# Altium schematic sheet 07 POWER.SchDoc
size 420 x 297 mm
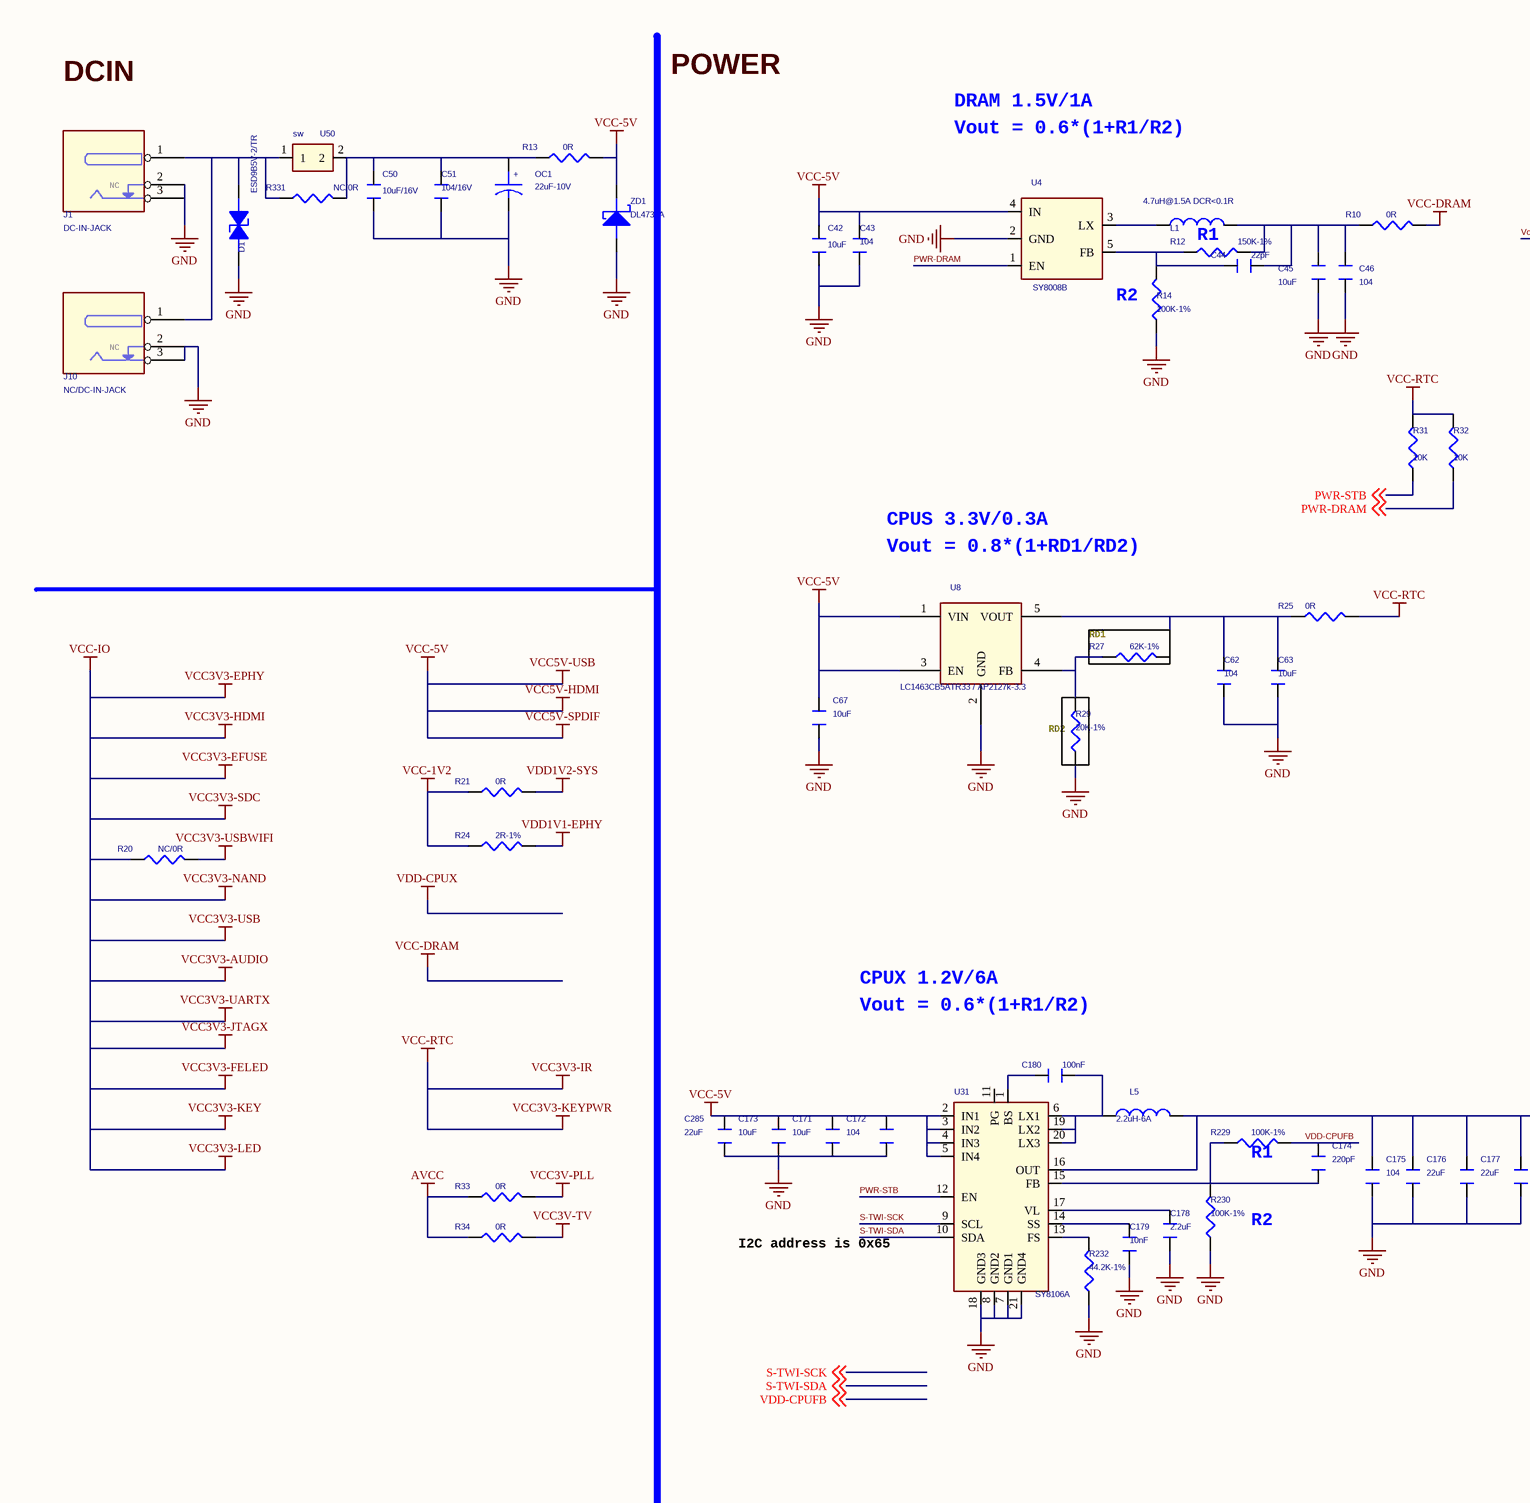
[diagram p0: 07 POWER.SchDoc, top left]
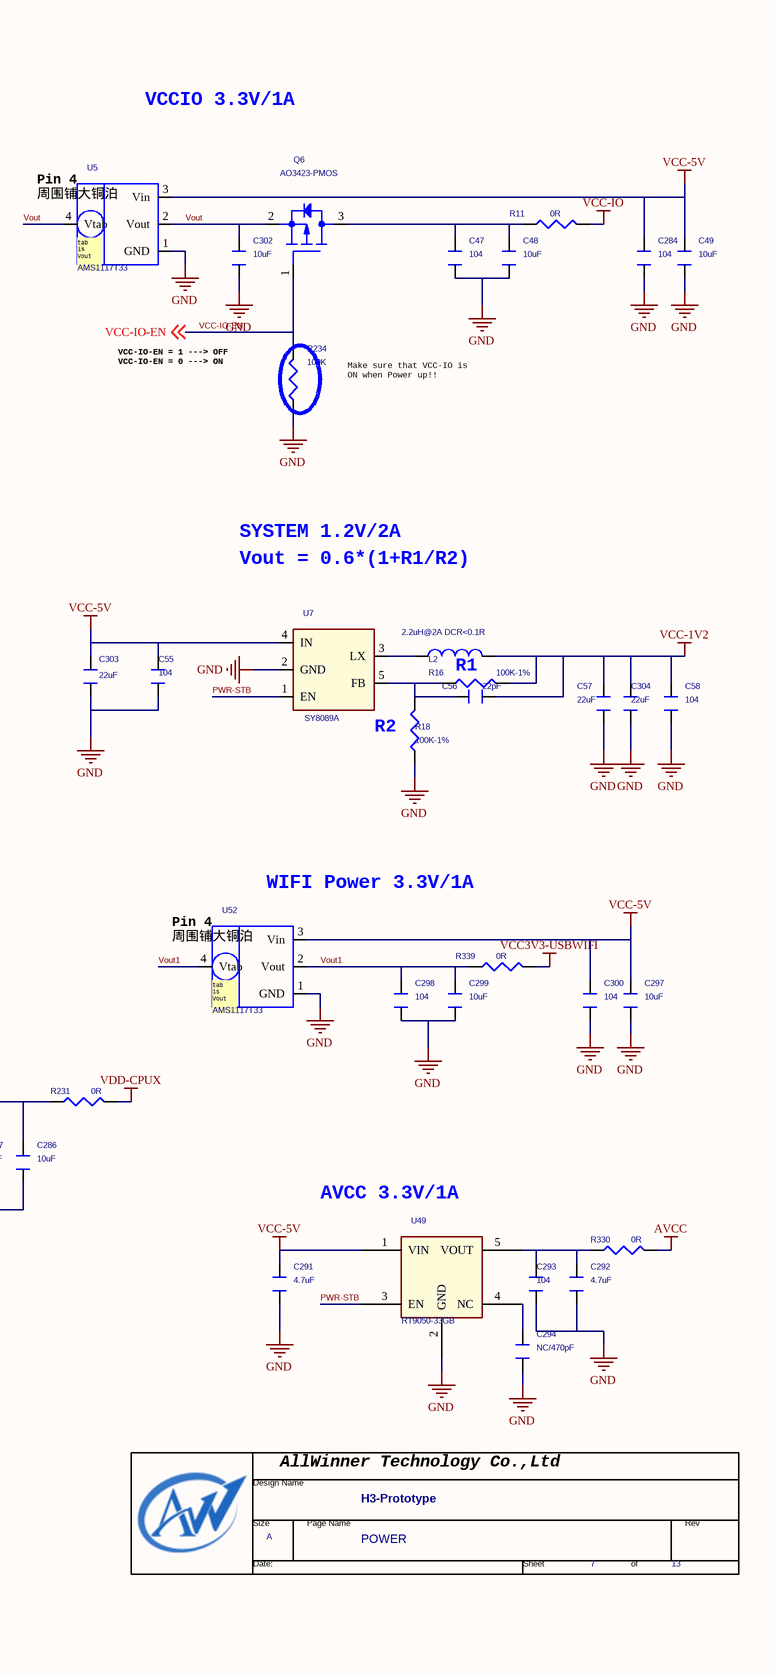
[diagram p1: 07 POWER.SchDoc, top right]
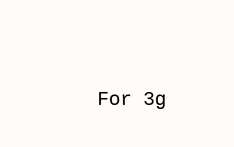
[diagram p2: 07 POWER.SchDoc, bottom left]

## Parts
*  Page Count: 13  Page Number: 7  Page Size: A  Title: H3-Prototype  Doc: POWER  (hidden comment: TitleBlock0-AW)  (graphical)
C42  10uF  [C0805]
C43  104  [C0402]
C44  22pF  [C0402]
C45  10uF  [C0805]
C46  104  [C0402]
C47  104  [C0402]
C48  10uF  [C0805]
C49  10uF  [C0805]
C50  10uF/16V  [C0805]
C51  104/16V  [C0402]
C55  104  [C0402]
C56  22pF  [C0402]
C57  22uF  [C0805]
C58  104  [C0402]
C62  104  [C0402]
C63  10uF  [C0805]
C67  10uF  [C0805]
C171  10uF  [C0805]
C172  104  [C0402]
C173  10uF  [C0805]
C174  220pF  [C0402]
C175  104  [C0402]
C176  22uF  [C0805]
C177  22uF  [C0805]
C178  2.2uF  [C0402]
C179  10nF  [C0402]
C180  100nF  [C0402]
C284  104  [C0402]
C285  22uF  [C0805]
C286  10uF  [C0805]
C291  4.7uF  [C0603]
C292  4.7uF  [C0603]
C293  104  [C0402]
C294  NC/470pF  [C0402]
C297  10uF  [C0805]
C298  104  [C0402]
C299  10uF  [C0805]
C300  104  [C0402]
C302  10uF  [C0805]
C303  22uF  [C0805]
C304  22uF  [C0805]
D1  ESD9B5V-2/TR  [C0402]
J1  DC-IN-JACK  [MJACK5PIN]
J10  NC/DC-IN-JACK  [MJACK5PIN]
L1  4.7uH@1.5A DCR<0.1R  [CD32]
L2  2.2uH@2A DCR<0.1R  [CD32]
L5  2.2uH-6A  [CD75]
OC1  22uF-10V  [C1210]
Q6  AO3423-PMOS  [SOT-23]
R10  0R  [R0603]
R11  0R  [R0603]
R12  150K-1%  [R0402]
R13  0R  [R0805]
R14  100K-1%  [R0402]
R16  100K-1%  [R0402]
R18  100K-1%  [R0402]
R20  NC/0R  [R0603]
R21  0R  [R0805]
R24  2R-1%  [R0402]
R25  0R  [R0603]
R27  62K-1%  [R0402]
R29  20K-1%  [R0402]
R31  10K  [R0402]
R32  10K  [R0402]
R33  0R  [R0603]
R34  0R  [R0603]
R229  100K-1%  [R0402]
R230  100K-1%  [R0402]
R231  0R  [R0603]
R232  44.2K-1%  [R0402]
R234  100K  [0805]
R330  0R  [R0603]
R331  NC/0R  [R1206]
R339  0R  [R0603]
U4  SY8008B  [SOT23-5]
U5  AMS1117T33  [SOT-223]
U7  SY8089A  [SOT23-5]
U8  LC1463CB5ATR33 / AP2127k-3.3  [SOT23-5]
U31  SY8106A  [QFN21P0_45B3_00X3_00H0_90]
U49  RT9050-33GB  [SOT23-5]
U50  sw  [XH-2-2_54]
U52  AMS1117T33  [SOT-223]
ZD1  DL4735A  [SOD123]

## Nets
AVCC: R33.1 R34.1 R330.2
GND: C42.2 C43.2 C45.2 C46.2 C47.1 C48.1 C49.1 C50.2 C51.2 C55.2 C57.2 C58.2 C62.1 C63.1 C67.1 C171.2 C172.2 C173.2 C175.1 C176.1 C177.1 C178.1 C179.1 C284.1 C285.2 C286.1 C291.1 C292.1 C293.1 C294.1 C297.1 C298.1 C299.1 C300.1 C302.1 C303.2 C304.2 D1.2(CATHODE) J1.2(GND0) J1.3(GND1) J10.2(GND0) J10.3(GND1) OC1.2 R14.1 R18.1 R29.1 R230.1 R232.1 R234.1 U4.2(GND) U5.1(GND) U7.2(GND) U8.2(GND) U31.7(GND1) U31.8(GND2) U31.18(GND3) U31.21(GND4) U49.2(GND) U52.1(GND) ZD1.A
VCC3V3-USBWIFI: R20.2 R339.2
VCC3V-PLL: R33.2
VCC3V-TV: R34.2
VCC-1V2: C56.2 C57.1 C58.1 C304.1 L2.2 R16.2 R21.1 R24.1
VCC-5V: C42.1 C43.1 C49.2 C55.1 C67.2 C171.1 C172.1 C173.1 C284.2 C285.1 C291.2 C297.2 C300.2 C303.1 R13.2 U4.4(IN) U5.3(Vin) U7.4(IN) U8.1(VIN) U8.3(EN) U31.2(IN1) U31.3(IN2) U31.4(IN3) U31.5(IN4) U49.1(VIN) U52.3(Vin) ZD1.C  [also labelled VCC5V-HDMI, VCC5V-SPDIF, VCC5V-USB]
VCC-DRAM: R10.2
VCC-IO: R11.2 R20.1  [also labelled VCC3V3-AUDIO, VCC3V3-EFUSE, VCC3V3-EPHY, VCC3V3-FELED, VCC3V3-HDMI, VCC3V3-JTAGX, VCC3V3-KEY, VCC3V3-LED, VCC3V3-NAND, VCC3V3-SDC, VCC3V3-UARTX, VCC3V3-USB]
VCC-RTC: R25.2 R31.2 R32.2  [also labelled VCC3V3-IR, VCC3V3-KEYPWR]
VDD1V1-EPHY: R24.2
VDD1V2-SYS: R21.2
VDD-CPUX: R231.2
PWR-DRAM: R32.1 U4.1(EN) ; off-sheet PWR-DRAM
PWR-STB: R31.1 U7.1(EN) U31.12(EN) U49.3(EN) ; off-sheet PWR-STB
S-TWI-SCK: U31.9(SCL) ; off-sheet S-TWI-SCK
S-TWI-SDA: U31.10(SDA) ; off-sheet S-TWI-SDA
VCC-IO-EN: Q6.1(GATE) R234.2 ; off-sheet VCC-IO-EN
VDD-CPUFB: C174.2 R229.2 ; off-sheet VDD-CPUFB
Vout: C302.2 Q6.2(SOURCE) U5.2(Vout) U5.4(Vtab)
Vout1: C298.2 C299.2 R339.1 U52.2(Vout) U52.4(Vtab)
NetC44_1: C44.1 R12.1 R14.2 U4.5(FB)
NetC44_2: C44.2 C45.1 C46.1 L1.2 R10.1 R12.2
NetC47_2: C47.2 C48.2 Q6.3(DRAIN) R11.1
NetC50_1: C50.1 C51.1 OC1.1 R13.1 R331.2 U50.2
NetC56_1: C56.1 R16.1 R18.2 U7.5(FB)
NetC62_2: C62.2 C63.2 R25.1 R27.2 U8.5(VOUT)
NetC174_1: C174.1 R229.1 R230.2 U31.15(FB)
NetC175_2: C175.2 C176.2 C177.2 C286.2 L5.2 R231.1 U31.16(OUT)
NetC178_2: C178.2 U31.17(VL)
NetC179_2: C179.2 U31.14(SS)
NetC180_1: C180.1 L5.1 U31.6(LX1) U31.19(LX2) U31.20(LX3)
NetC180_2: C180.2 U31.1(BS)
NetC292_2: C292.2 C293.2 R330.1 U49.5(VOUT)
NetC294_2: C294.2 U49.4(NC)
NetD1_1: D1.1(ANODE) J1.1(IN) J10.1(IN) R331.1 U50.1
NetL1_1: L1.1 U4.3(LX)
NetL2_1: L2.1 U7.3(LX)
NetR27_1: R27.1 R29.2 U8.4(FB)
NetR232_2: R232.2 U31.13(FS)

Not connected (* = marked no-connect by the designer): U31 11(PG)

## Notes on the sheet
- DCIN
- POWER
- DRAM 1.5V/1A
- VCCIO 3.3V/1A
- Vout = 0.6*(1+R1/R2)
- (near U5) Pin 4
  周围铺大铜泊
- (near L1) R1
- R2
- (near R234) VCC-IO-EN = 1 ---> OFF
  VCC-IO-EN = 0 ---> ON
- Make sure that VCC-IO is
  ON when Power up!!
- CPUS 3.3V/0.3A
- Vout = 0.8*(1+RD1/RD2)
- SYSTEM 1.2V/2A
- (near R27) RD1
- (near R29) RD2
- (near L2) R1
- (near U52) Pin 4
  周围铺大铜泊
- (near U52) WIFI Power 3.3V/1A
- CPUX 1.2V/6A
- (near R229) R1
- I2C address is 0x65
- (near U49) AVCC 3.3V/1A
- For 3g
- (in symbol AMS1117T33_2) tab / is / Vout
- (in symbol CAPACITOR_POL_0) +
- (in symbol PHONEJack_DCIN_0) NC
- (in symbol TitleBlock0-AW) AllWinner Technology Co.,Ltd; Design Name; Size; Page Name; Rev; Date:; Sheet; of

## Library data of the parts
C42 C45 C50 C57 C171 C173 C285 C303 = CAPACITOR_1: PAGE: 1
C43 C44 C46 C51 C55 C56 C58 C172 C304 = CAPACITOR_1_Dup1: PAGE: 1
C47-C49 C62 C63 C67 C174-C180 C284 C286 C291-C294 C297-C300 C302 = CAPACITOR
D1 = 1_1.5KE100A_Dup1: 1ST PART DESCRIPTION: WILL ESD9B5V Bidirection ESD Protection
J1 J10 = PHONEJack_DCIN_0: SDTSourceLibName: c:\tmp\LM4560.LIB; 02 DESC: CONN,  Power Jack F; 01 IPN: -; 03 MAN: -; 04 MPN: -
L1 L2 = INDUCTOR_1
L5 = INDUCTOR_5: RoHS Power Inductor 22uH 300mA H<1.8MM,CD32
OC1 = CAPACITOR_POL_0
Q6 = PMOS_0
R10-R13 R16 R20 R21 R24 R25 R31-R34 R231 R330 R331 R339 = R_Dup4
R14 R18 R27 R29 R229 R230 R232 = R_Dup3
R234 = R1_0805
U4 U7 = SY8088
U5 U52 = AMS1117T33_2
U8 = uP0107_0
U31 = SY8106a_0
U49 = RT9050
ZD1 = DIODE_SCHOTTKY_3
* = TitleBlock0-AW: Page Create Date: March  8, 1995